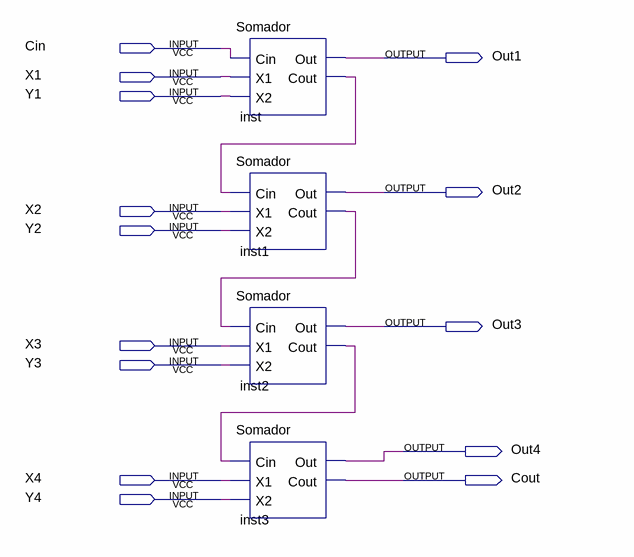
[diagram p0: schematic sheet]
// Quartus schematic Somador4Bits.bdf as structural Verilog: 4 symbols, 14 pins
module Somador4Bits (
  input  Cin,
  input  X1,
  input  Y1,
  input  X2,
  input  Y2,
  input  X3,
  input  Y3,
  input  X4,
  input  Y4,
  output Out1,
  output Out2,
  output Out3,
  output Out4,
  output Cout
);

  wire inst1_cout, inst2_cout, inst_cout;

  Somador inst (.Cin(Cin), .X1(X1), .X2(Y1), .Out(Out1), .Cout(inst_cout));
  Somador inst1 (.Cin(inst_cout), .X1(X2), .X2(Y2), .Out(Out2), .Cout(inst1_cout));
  Somador inst2 (.Cin(inst1_cout), .X1(X3), .X2(Y3), .Out(Out3), .Cout(inst2_cout));
  Somador inst3 (.Cin(inst2_cout), .X1(X4), .X2(Y4), .Out(Out4), .Cout(Cout));
endmodule
